# Altium schematic sheet MCU.SchDoc
size A4; Organization: Altium Limited; Address1: L3, 12a Rodborough Rd; Address2: Frenchs Forest; Address3: NSW; Address4: Australia 2086
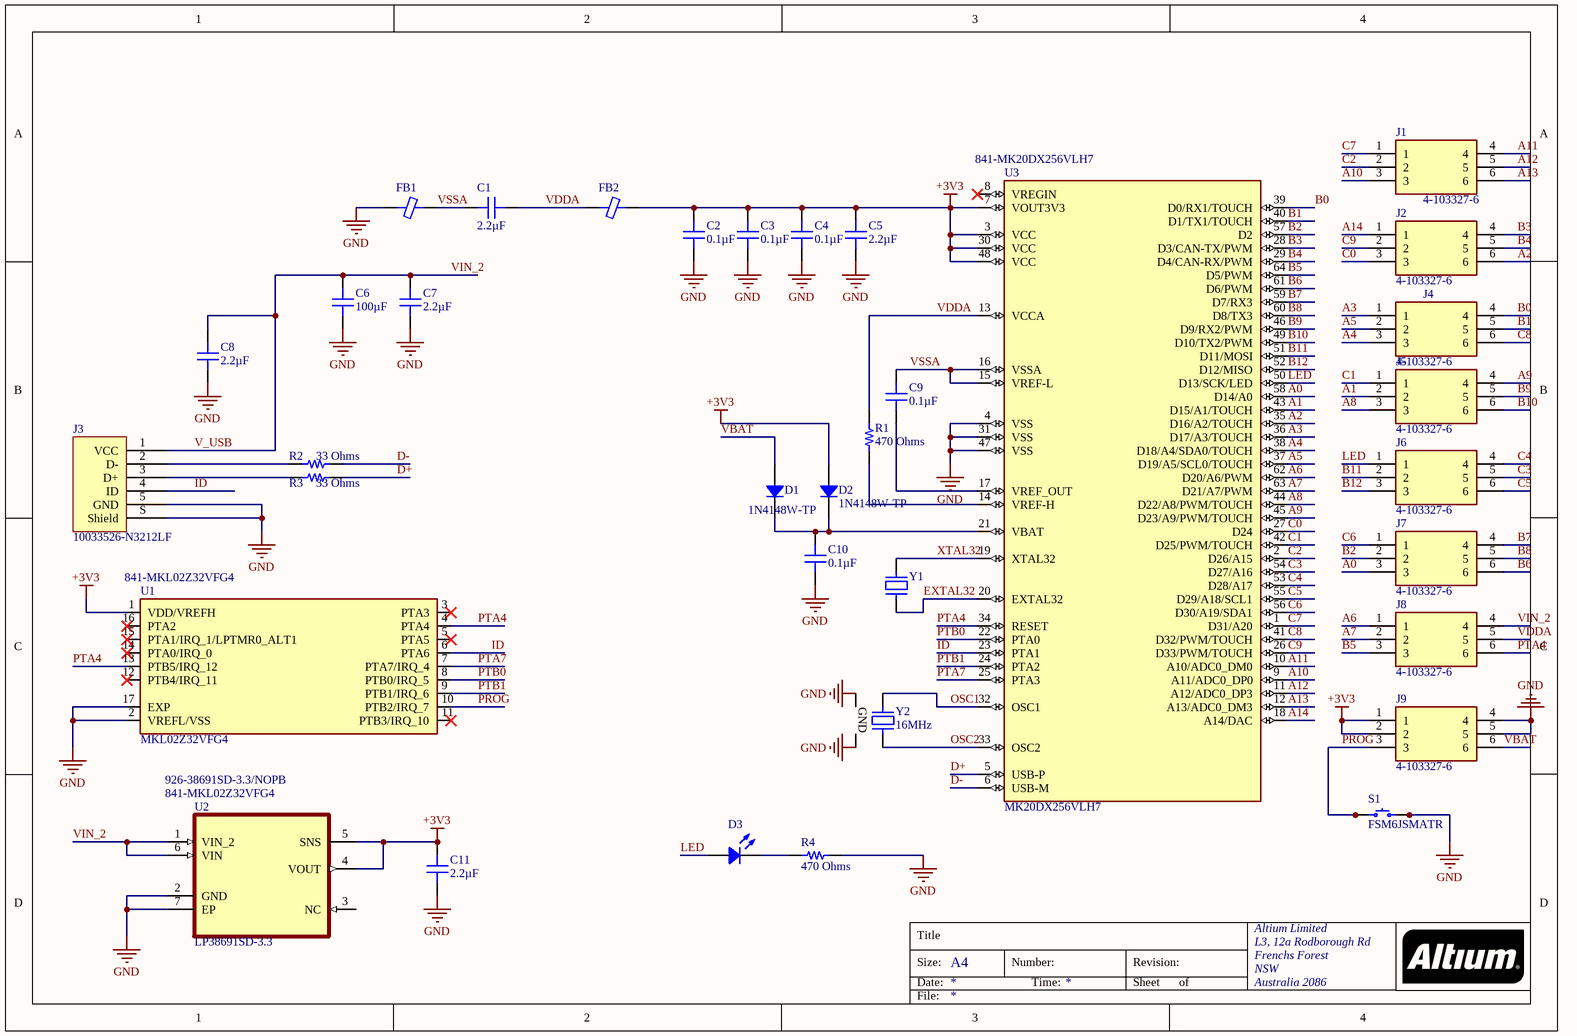
[diagram p0: MCU.SchDoc]

## Parts
C1  2.2µF  [CAP 0805_2012]
C2  0.1µF  [CAP 0805_2012]
C3  0.1µF  [CAP 0805_2012]
C4  0.1µF  [CAP 0805_2012]
C5  2.2µF  [CAP 0805_2012]
C6  100µF  [CAP 0805_2012]
C7  2.2µF  [CAP 0805_2012]
C8  2.2µF  [CAP 0805_2012]
C9  0.1µF  [CAP 0805_2012]
C10  0.1µF  [CAP 0805_2012]
C11  2.2µF  [CAP 0805_2012]
D1  1N4148W-TP  [SOD-123]
D2  1N4148W-TP  [SOD-123]
D3  JE2835AWT-00-0000-000A0HG830E  [CREE J 2835]  (value not drawn)
FB1  600 Ohms @ 100MHz  [FER 0805_2012]  (value not drawn)
FB2  600 Ohms @ 100MHz  [FER 0805_2012]  (value not drawn)
J1  4-103327-6  [TE_4-103327-6]
J2  4-103327-6  [TE_4-103327-6]
J3  10033526-N3212LF  [FCI USB 10033526-N3212LF]
J4  4-103327-6  [TE_4-103327-6]
J5  4-103327-6  [TE_4-103327-6]
J6  4-103327-6  [TE_4-103327-6]
J7  4-103327-6  [TE_4-103327-6]
J8  4-103327-6  [TE_4-103327-6]
J9  4-103327-6  [TE_4-103327-6]
R1  470 Ohms  [RES 0805_2012]
R2  33 Ohms  [RES 0805_2012]
R3  33 Ohms  [RES 0805_2012]
R4  470 Ohms  [RES 0805_2012]
S1  FSM6JSMATR  [TE FSM6JSMA]
U1  MKL02Z32VFG4  Supplier Part Number 1: 841-MKL02Z32VFG4  [QFN50P300X300X65-17N]
U2  LP38691SD-3.3  Supplier Part Number 1: 841-MKL02Z32VFG4  Supplier Part Number 2: 926-38691SD-3.3/NOPB  [DFN300X300X80-7N]
U3  MK20DX256VLH7  Supplier Part Number 1: 841-MK20DX256VLH7  [QFP50P1200X1200X160-64N]
Y1  32.768kHz  [ABRACON ABS06]  (value not drawn)
Y2  16MHz  [NDK NX3225SA]

## Nets
+3V3: C2.2 C3.2 C4.2 C5.2 C11.2 D2.1 FB2.1 J9.1 J9.2 U1.1(VDD/VREFH) U2.4(VOUT) U2.5(SNS) U3.3(VCC) U3.7(VOUT3V3) U3.30(VCC) U3.48(VCC)
GND: C2.1 C3.1 C4.1 C5.1 C6.1 C7.1 C8.1 C10.1 C11.1 FB1.2 J3.5(GND) J3.S(Shield) J9.4 J9.5 R4.2 S1.3 S1.4 U1.2(VREFL/VSS) U1.17(EXP) U2.2(GND) U2.7(EP) U3.4(VSS) U3.31(VSS) U3.47(VSS) Y2.2(GND) Y2.4(GND)
A0: J7.3 U3.58(D14/A0)
A1: J5.2 U3.43(D15/A1/TOUCH)
A2: J2.6 U3.35(D16/A2/TOUCH)
A3: J4.1 U3.36(D17/A3/TOUCH)
A4: J4.3 U3.38(D18/A4/SDA0/TOUCH)
A5: J4.2 U3.37(D19/A5/SCL0/TOUCH)
A6: J8.1 U3.62(D20/A6/PWM)
A7: J8.2 U3.63(D21/A7/PWM)
A8: J5.3 U3.44(D22/A8/PWM/TOUCH)
A9: J5.4 U3.45(D23/A9/PWM/TOUCH)
A10: J1.3 U3.9(A11/ADC0_DP0)
A11: J1.4 U3.10(A10/ADC0_DM0)
A12: J1.5 U3.11(A12/ADC0_DP3)
A13: J1.6 U3.12(A13/ADC0_DM3)
A14: J2.1 U3.18(A14/DAC)
B0: J4.4 U3.39(D0/RX1/TOUCH)
B1: J4.5 U3.40(D1/TX1/TOUCH)
B2: J7.2 U3.57(D2)
B3: J2.4 U3.28(D3/CAN-TX/PWM)
B4: J2.5 U3.29(D4/CAN-RX/PWM)
B5: J8.3 U3.64(D5/PWM)
B6: J7.6 U3.61(D6/PWM)
B7: J7.4 U3.59(D7/RX3)
B8: J7.5 U3.60(D8/TX3)
B9: J5.5 U3.46(D9/RX2/PWM)
B10: J5.6 U3.49(D10/TX2/PWM)
B11: J6.2 U3.51(D11/MOSI)
B12: J6.3 U3.52(D12/MISO)
C0: J2.3 U3.27(D24)
C1: J5.1 U3.42(D25/PWM/TOUCH)
C2: J1.2 U3.2(D26/A15)
C3: J6.5 U3.54(D27/A16)
C4: J6.4 U3.53(D28/A17)
C5: J6.6 U3.55(D29/A18/SCL1)
C6: J7.1 U3.56(D30/A19/SDA1)
C7: J1.1 U3.1(D31/A20)
C8: J4.6 U3.41(D32/PWM/TOUCH)
C9: J2.2 U3.26(D33/PWM/TOUCH)
D+: R3.2 U3.5(USB-P)
D-: R2.2 U3.6(USB-M)
EXTAL32: U3.20(EXTAL32) Y1.1
ID: J3.4(ID) U1.6(PTA6) U3.23(PTA1)
LED: D3.1 J6.1 U3.50(D13/SCK/LED)
OSC1: U3.32(OSC1) Y2.1
OSC2: U3.33(OSC2) Y2.3
PROG: J9.3 S1.1 S1.2 U1.10(PTB2/IRQ_7)
PTA4: J8.6 U1.4(PTA4) U1.13(PTB5/IRQ_12) U3.34(RESET)
PTA7: U1.7(PTA7/IRQ_4) U3.25(PTA3)
PTB0: U1.8(PTB0/IRQ_5) U3.22(PTA0)
PTB1: U1.9(PTB1/IRQ_6) U3.24(PTA2)
V_USB: C6.2 C7.2 C8.2 J3.1(VCC) J8.4 U2.1(VIN_2) U2.6(VIN)  [also labelled VIN_2]
VBAT: D1.1 J9.6
VDDA: C1.1 FB2.2 J8.5 R1.2 U3.13(VCCA)
VSSA: C1.2 C9.2 FB1.1 U3.15(VREF-L) U3.16(VSSA)
XTAL32: U3.19(XTAL32) Y1.2
NetC9_1: C9.1 U3.17(VREF_OUT)
NetC10_2: C10.2 D1.2 D2.2 U3.21(VBAT)
NetD3_2: D3.2 R4.1
NetJ3_2: J3.2(D-) R2.1
NetJ3_3: J3.3(D+) R3.1
NetR1_1: R1.1 U3.14(VREF-H)

Not connected (* = marked no-connect by the designer): U1 3(PTA3)* 5(PTA5)* 11(PTB3/IRQ_10)* 12(PTB4/IRQ_11)* 14(PTA0/IRQ_0)* 15(PTA1/IRQ_1/LPTMR0_ALT1)* 16(PTA2)*; U2 3(NC); U3 8(VREGIN)*

## Notes on the sheet
- Title
- Size:
- Date:
- A4
- Number:
- Time:
- Revision:
- Sheet
- of
- File:

## Library data of the parts
C1 C5 C7 C8 C11 = CGA4J3X7R1H225K125AB: CAP CER 2.2UF 50V X7R 0805; Manufacturer: TDK Corporation; Tolerance: ±10%; Part Number: CGA4J3X7R1H225K125AB; Value: 2.2µF; Applications: Automotive; Capacitance: 2.2µF; ComponentLink1Description: Datasheet; ComponentLink1URL: https://product.tdk.com/info/en/catalog/datasheets/mlcc_automotive_general_en.pdf?ref_disty=digikey; ComponentLink2Description: DigiKey Link; ComponentLink2URL: http://digikey.com/product-detail/en/tdk-corporation/CGA4J3X7R1H225K125AB/445-174216-1-ND/5823086; Device Package: 0805 (2012 Metric); LastUpdated: 21.01.2020 00:03:05; Lifecycle Status: Active; Minimum Order: 1; Mounting Type: Surface Mount, MLCC; Operating Temperature: -55°C ~ 125°C; Package / Case: 0805 (2012 Metric); Packaging: TapeAndReel; PartId: 3113; Part Status: Active; Price: 0.12; Ratings: AEC-Q200; Series: CGA; Size / Dimension: 0.079" L x 0.049" W (2.00mm x 1.25mm); Supplier 1: DigiKey; Supplier Part Number 1: 445-174216-1-ND; Temperature Coefficient: X7R; Thickness (Max): 0.057" (1.45mm); Voltage - Rated: 50V
C2-C4 C9 C10 = C0805C104K1RECAUTO: CAP CER 0805 0.1UF 100V X7R; Manufacturer: KEMET; Tolerance: ±10%; Part Number: C0805C104K1RECAUTO; Value: 0.1µF; Applications: Automotive, ESD Protection; Capacitance: 0.1µF; ComponentLink1Description: Datasheet; ComponentLink1URL: https://api.kemet.com/component-edge/download/datasheet/C0805C104K1RECAUTO.pdf; ComponentLink2Description: DigiKey Link; ComponentLink2URL: http://digikey.com/product-detail/en/kemet/C0805C104K1RECAUTO/399-17169-1-ND/8563710; Device Package: 0805 (2012 Metric); LastUpdated: 21.01.2020 00:03:01; Lifecycle Status: Active; Minimum Order: 1; Mounting Type: Surface Mount, MLCC; Operating Temperature: -55°C ~ 125°C; Package / Case: 0805 (2012 Metric); Packaging: TapeAndReel; PartId: 5890; Part Status: Active; Price: 0.06; Ratings: AEC-Q200; Series: ESD SMD Auto X7R; Size / Dimension: 0.079" L x 0.049" W (2.00mm x 1.25mm); Supplier 1: DigiKey; Supplier Part Number 1: 399-17169-1-ND; Temperature Coefficient: X7R; Thickness (Max): 0.043" (1.10mm); Voltage - Rated: 100V
C6 = GRM21BR60J107ME15L: CAP CER 100UF 6.3V X5R 0805; Manufacturer: Murata Electronics; Tolerance: ±20%; Part Number: GRM21BR60J107ME15L; Value: 100µF; Applications: General Purpose; Capacitance: 100µF; ComponentLink1Description: Datasheet; ComponentLink1URL: https://search.murata.co.jp/Ceramy/image/img/A01X/G101/ENG/GRM21BR60J107ME15-01.pdf; ComponentLink2Description: DigiKey Link; ComponentLink2URL: http://digikey.com/product-detail/en/murata-electronics/GRM21BR60J107ME15L/490-13981-1-ND/6155811; Device Package: 0805 (2012 Metric); LastUpdated: 21.01.2020 00:02:41; Lifecycle Status: Active; Minimum Order: 1; Mounting Type: Surface Mount, MLCC; Operating Temperature: -55°C ~ 85°C; Package / Case: 0805 (2012 Metric); Packaging: TapeAndReel; PartId: 16995; Part Status: Active; Price: 0.65; Series: GRM; Size / Dimension: 0.079" L x 0.049" W (2.00mm x 1.25mm); Supplier 1: DigiKey; Supplier Part Number 1: 490-13981-1-ND; Temperature Coefficient: X5R; Thickness (Max): 0.057" (1.45mm); Voltage - Rated: 6.3V
D1 D2 = 1N4148W-TP: DIODE GEN PURP 100V 150MA SOD123; Manufacturer: Micro Commercial Co; Capacitance @ Vr, F: 2pF @ 0V, 1MHz; Current - Reverse Leakage @ Vr: 1µA @ 75V; Diode Type: Standard; Reverse Recovery Time (trr): 4ns; Speed: Small Signal =< 200mA (Io), Any Speed; Voltage - Forward (Vf) (Max) @ If: 1.25V @ 150mA; Part Number: 1N4148W-TP; ComponentLink1Description: Datasheet; ComponentLink1URL: https://www.mccsemi.com/pdf/Products/1N4148W(SOD123).pdf; ComponentLink2Description: DigiKey Link; ComponentLink2URL: http://digikey.com/product-detail/en/micro-commercial-co/1N4148W-TP/1N4148WTPMSCT-ND/717311; Current - Average Rectified (Io): 150mA; Device Package: SOD-123; LastUpdated: 21.01.2020 02:42:46; Lifecycle Status: Active; Minimum Order: 1; Mounting Type: Surface Mount; Operating Temperature - Junction: -65°C ~ 150°C; Package / Case: SOD-123; Packaging: TapeAndReel; PartId: 999; Part Status: Active; Price: 0.02; Series: -; Supplier 1: DigiKey; Supplier Part Number 1: 1N4148WTPMSCT-ND; Supplier Device Package: SOD-123; Voltage - DC Reverse (Vr) (Max): 100V
D3 = JE2835AWT-00-0000-000A0HG830E: CREE J SERIES JE2835 LIGHT EMITT; Manufacturer: Cree Inc.; CCT (K): 3000K; Color: 0.138" L x 0.110" W (3.50mm x 2.80mm); CRI (Color Rendering Index): 80; Current - Max: 240mA; Current - Test: 150mA; Flux @ 25°C, Current - Test: 70lm (Typ); Lumens/Watt @ Current - Test: 156 lm/W; Viewing Angle: 120°; Voltage - Forward (Vf) (Typ): 3V; Part Number: JE2835AWT-00-0000-000A0HG830E; ComponentLink1Description: Datasheet; ComponentLink1URL: https://www.cree.com/led-components/media/documents/data-sheet-JSeries-2835-3v.pdf; ComponentLink2Description: DigiKey Link; ComponentLink2URL: http://digikey.com/product-detail/en/cree-inc/JE2835AWT-00-0000-000A0HG830E/JE2835AWT-00-0000-000A0HG830ECT-ND/9974552; Device Package: 1113 (2835 Metric); Height - Seated (Max): 0.035" (0.90mm); LastUpdated: 2.04.2020 13:35:29; Lifecycle Status: Active; Minimum Order: 1; Mounting Type: Surface Mount; Package / Case: 1113 (2835 Metric); Packaging: TapeAndReel; PartId: 48; Part Status: 1113 (2835 Metric); Price: 0.02; Series: J; Size / Dimension: 0.138" L x 0.110" W (3.50mm x 2.80mm); Supplier 1: DigiKey; Supplier Part Number 1: JE2835AWT-00-0000-000A0HG830ECT-ND; Supplier Device Package: SMD
FB1 FB2 = MPZ2012S601AT000: FERRITE BEAD 600 OHM 0805 1LN; Manufacturer: TDK Corporation; Current Rating (Max): 2A; DC Resistance (DCR) (Max): 100mOhm; Filter Type: Power Line; Number of Lines: 1; Part Number: MPZ2012S601AT000; ComponentLink1Description: Datasheet; ComponentLink1URL: https://product.tdk.com/info/en/catalog/datasheets/beads_commercial_power_mpz2012_en.pdf?ref_disty=digikey; ComponentLink2Description: DigiKey Link; ComponentLink2URL: http://digikey.com/product-detail/en/tdk-corporation/MPZ2012S601AT000/445-2206-1-ND/765104; Device Package: 0805 (2012 Metric); Height (Max): 0.041" (1.05mm); Impedance @ Frequency: 600 Ohms @ 100MHz; LastUpdated: 21.01.2020 02:29:16; Lifecycle Status: Active; Minimum Order: 1; Mounting Type: Surface Mount; Operating Temperature: -55°C ~ 125°C; Package / Case: 0805 (2012 Metric); Packaging: TapeAndReel; PartId: 1392; Part Status: Active; Price: 0.03; Series: MPZ; Size / Dimension: 0.079" L x 0.049" W (2.00mm x 1.25mm); Supplier 1: DigiKey; Supplier Part Number 1: 445-2206-1-ND; Value: 600 Ohms @ 100MHz
J1 J2 J4-J9 = 4-103327-6: 6 Position Single Row 2.54 mm Through-Hole Straight AMPMODU Breakaway Header; Centerline_Pitch: 2.54 mm[.1 in]; MF: TE Connectivity; Product_Type: Connector; Number_of_Positions: 6; SnapEDA_Link: https://www.snapeda.com/parts/4-103327-6/TE%20Connectivity%20AMP%20Connectors/view-part/2779147/?ref=snap; TE_purchase_URL: https://www.te.com/usa-en/product-4-103327-6.html?te_bu=Cor&te_type=disp&te_campaign=seda_glo_cor-seda-global-disp-prtnr-fy19-seda-model-bom-cta_sma-317_1&elqCampaignId=32493; Availability: Unavailable; Price: None; MP: 4-103327-6; Package: None; Value: *
J3 = 10033526-N3212LF: CONN RCPT MINI USB B 5POS SMD RA; Manufacturer: Amphenol ICC (FCI); Connector Type: USB - mini B; Current Rating (Amps): 1A per Contact; Gender: Receptacle; Mating Cycles: 5000; Number of Contacts: 5; Number of Ports: 1; Shielding: Shielded; Voltage - Rated: 30V; Part Number: 10033526-N3212LF; ComponentLink1Description: Datasheet; ComponentLink1URL: http://www.amphenol-icc.com/media/wysiwyg/files/drawing/10033526.pdf; ComponentLink2Description: DigiKey Link; ComponentLink2URL: //digikey.com/product-detail/en/amphenol-icc-fci/10033526-N3212LF/609-4700-2-ND/4292074; Features: Board Guide, Solder Retention; LastUpdated: 9.12.2019 20:52:14; Lifecycle Status: 0; Minimum Order: 1; Mounting Feature: Horizontal; Mounting Type: Surface Mount, Right Angle; Operating Temperature: -25°C ~ 85°C; Packaging: TapeAndReel; Part Status: Active; Price: 0.39; Series: -; Supplier 1: DigiKey; Supplier Part Number 1: 609-4700-2-ND; Termination: Solder
R1 = CPF0805B470RE1: RES SMD 470 OHM 0.1% 1/10W 0805; Manufacturer: TE Connectivity Passive Product; Power (Watts): 0.1W, 1/10W; Temperature Coefficient: ±25ppm/°C; Part Number: CPF0805B470RE1; Value: 470 Ohms; ComponentLink1Description: Datasheet; ComponentLink1URL: https://www.te.com/commerce/DocumentDelivery/DDEController?Action=srchrtrv&DocNm=1773200&DocType=DS&DocLang=English; ComponentLink2Description: DigiKey Link; ComponentLink2URL: http://digikey.com/product-detail/en/te-connectivity-passive-product/CPF0805B470RE1/A103263CT-ND/2728833; Composition: Thin Film; Device Package: 0805 (2012 Metric); Height - Seated (Max): 0.026" (0.65mm); LastUpdated: 21.01.2020 01:48:16; Lifecycle Status: Active; Minimum Order: 1; Number of Terminations: 2; Operating Temperature: -55°C ~ 155°C; Package / Case: 0805 (2012 Metric); Packaging: TapeAndReel; PartId: 31840; Part Status: Active; Price: 0.12; Resistance: 470 Ohms; Series: CPF, Neohm; Size / Dimension: 0.079" L x 0.049" W (2.00mm x 1.25mm); Supplier 1: DigiKey; Supplier Part Number 1: A103263CT-ND; Supplier Device Package: 0805; Tolerance: ±0.1%
R2 R3 = CPF0805B33RE1: RES SMD 33 OHM 0.1% 1/10W 0805; Manufacturer: TE Connectivity Passive Product; Power (Watts): 0.1W, 1/10W; Temperature Coefficient: ±25ppm/°C; Part Number: CPF0805B33RE1; Value: 33 Ohms; ComponentLink1Description: Datasheet; ComponentLink1URL: https://www.te.com/commerce/DocumentDelivery/DDEController?Action=srchrtrv&DocNm=1773200&DocType=DS&DocLang=English; ComponentLink2Description: DigiKey Link; ComponentLink2URL: http://digikey.com/product-detail/en/te-connectivity-passive-product/CPF0805B33RE1/A103197CT-ND/2728757; Composition: Thin Film; Device Package: 0805 (2012 Metric); Height - Seated (Max): 0.026" (0.65mm); LastUpdated: 21.01.2020 01:40:43; Lifecycle Status: Active; Minimum Order: 1; Number of Terminations: 2; Operating Temperature: -55°C ~ 155°C; Package / Case: 0805 (2012 Metric); Packaging: TapeAndReel; PartId: 47504; Part Status: Active; Price: 0.12; Resistance: 33 Ohms; Series: CPF, Neohm; Size / Dimension: 0.079" L x 0.049" W (2.00mm x 1.25mm); Supplier 1: DigiKey; Supplier Part Number 1: A103197CT-ND; Supplier Device Package: 0805; Tolerance: ±0.1%
R4 = RMCF0805FT470R: RES 470 OHM 1% 1/8W 0805; Manufacturer: Stackpole Electronics Inc; Power (Watts): 0.125W, 1/8W; Temperature Coefficient: ±100ppm/°C; Part Number: RMCF0805FT470R; Value: 470 Ohms; ComponentLink1Description: Datasheet; ComponentLink1URL: https://www.seielect.com/catalog/sei-packaging.pdf; ComponentLink2Description: DigiKey Link; ComponentLink2URL: http://digikey.com/product-detail/en/stackpole-electronics-inc/RMCF0805FT470R/RMCF0805FT470RCT-ND/1942356; Composition: Thick Film; Device Package: 0805 (2012 Metric); Features: Automotive AEC-Q200; Height - Seated (Max): 0.026" (0.65mm); LastUpdated: 21.01.2020 01:48:04; Lifecycle Status: Active; Minimum Order: 1; Number of Terminations: 2; Operating Temperature: -55°C ~ 155°C; Package / Case: 0805 (2012 Metric); Packaging: CutTape; PartId: 32394; Part Status: Active; Price: 0.10; Ratings: AEC-Q200; Resistance: 470 Ohms; Series: RMCF; Size / Dimension: 0.079" L x 0.049" W (2.00mm x 1.25mm); Supplier 1: DigiKey; Supplier Part Number 1: RMCF0805FT470RCT-ND; Supplier Device Package: 0805; Tolerance: ±1%
S1 = FSM6JSMATR: SWITCH TACTILE SPST-NO 0.05A 24V; Manufacturer: TE Connectivity ALCOSWITCH Switches; Actuator Height off PCB, Vertical: 7.00mm; Actuator Orientation: Top Actuated; Actuator Type: Standard; Contact Rating @ Voltage: 0.05A @ 24VDC; Illumination: Non-Illuminated; Operating Force: 160gf; Outline: 6.00mm x 6.00mm; Switch Function: Off-Mom; Part Number: FSM6JSMATR; Circuit: SPST-NO; ComponentLink1Description: Datasheet; ComponentLink1URL: https://www.te.com/commerce/DocumentDelivery/DDEController?Action=srchrtrv&DocNm=1308111-1_SWITCHES_CORE_PROGRAM_CATALOG&DocType=CS&DocLang=English; ComponentLink2Description: DigiKey Link; ComponentLink2URL: http://digikey.com/product-detail/en/te-connectivity-alcoswitch-switches/FSM6JSMATR/450-2058-1-ND/4569748; LastUpdated: 4.02.2020 14:39:39; Lifecycle Status: Active; Minimum Order: 1; Mounting Type: Surface Mount; Operating Temperature: -35°C ~ 85°C; Packaging: TapeAndReel; Part Status: Active; Price: 0.25; Series: FSMJSMA; Supplier 1: DigiKey; Supplier Part Number 1: 450-2058-1-ND; Termination Style: Gull Wing
U1 = MKL02Z32VFG4: IC MCU 32BIT 32KB FLASH 16QFN; Manufacturer: NXP Freescale; MF: NXP USA; Frequency: 48MHz; Number of I/Os: 14; Oscillator Type: Internal; Data Bus Width: 32b; Core Architecture: ARM; Max Supply Voltage: 3.6V; RAM Size: 4KB; Number of Timers/Counters: 2; Peripherals: Brown-out Detect/Reset,POR,PWM,WDT,LVD; Interface: I2C,SPI,UART,USART; Min Supply Voltage: 1.71V; Number of SPI Channels: 1; Availability: Unavailable; MP: MKL02Z32VFG4; Price: None; Value: *; SnapEDA_Link: https://www.snapeda.com/parts/MKL02Z32VFG4/NXP%20USA%20Inc./view-part/492537/?ref=snap; Package: QFN-16 NXP Semiconductors; Supplier 1: Mouser; Manufacturer Part Number: MKL02Z32VFG4; RoHS: Yes; Category: Microcontrollers; Stock 1: 3878; Pricing 1: 1=2.49000, 10=2.12000, 100=1.69000, 500=1.48000, 1000=1.22000, 2500=1.14000 (USD); Mount: Surface Mount; Case/Package: QFN; Number of Pins: 16; Weight: 0.000564oz; Min Operating Temperature: -40°C; Max Operating Temperature: 105°C; Max Frequency: 48MHz; Memory Type: FLASH; Memory Size: 32KB; Packaging: Tray; Package Quantity: 490; Number of I2C Channels: 2; Number of USB Channels: 1; Number of PWM Channels: 2; Number of ADC Channels: 1; Number of UART Channels: 1; Length: 3mm; Height: 0.75mm; Width: 3mm; REACH SVHC: No SVHC; ComponentLink1URL: https://datasheet.ciiva.com/18627/kl02p32m48sf0-18627235.pdf?src-supplier=Digi-Key; ComponentLink1Description: https://datasheet.ciiva.com/18627/kl02p32m48sf0-18627235.pdf?src-supplier=Digi-Key; ComponentLink2URL: https://datasheet.ciiva.com/30476/0900766b812babaa-30476287.pdf?src-supplier=RSComponents; ComponentLink2Description: https://datasheet.ciiva.com/30476/0900766b812babaa-30476287.pdf?src-supplier=RSComponents; ComponentLink3URL: https://datasheet.ciiva.com/46450/1816137-46450442.pdf?src-supplier=Element14; ComponentLink3Description: https://datasheet.ciiva.com/46450/1816137-46450442.pdf?src-supplier=Element14
U2 = LP38691SD-3.3: IC REG LINEAR 3.3V 500MA 6WSON; Manufacturer: TI National Semiconductor; Manufacturer Part Number: LP38691SD-3.3/NOPB; MF: Texas Instruments; Number of Outputs: 1; Min Input Voltage: 2.7V; Max Input Voltage: 10V; Quiescent Current: 100uA; Accuracy: 2%; Polarity: Positive; Output Type: Fixed; Dropout Voltage: 330mV; Price: None; Value: *; Package: WDFN-6 Texas Instruments; Availability: Unavailable; SnapEDA_Link: https://www.snapeda.com/parts/LP38691SD-3.3/Texas%20Instruments/view-part/569979/?ref=snap; MP: LP38691SD-3.3; Supplier 1: Mouser; Supplier 2: Mouser; RoHS: Yes; Category: Voltage Regulators - Linear; Stock 2: 6886; Pricing 2: 1=1.70000, 10=1.44000, 100=1.15000, 250=1.01000, 500=0.97800, 1000=0.77700 (USD); Mount: Surface Mount; Number of Pins: 6; Contact Plating: Tin; Min Operating Temperature: -40°C; Max Operating Temperature: 125°C; Max Output Current: 500mA; Output Voltage: 3.3V; Output Voltage Accuracy: 2%; Output Current: 500mA; Packaging: Tape and Reel; Package Quantity: 1000; Number of Regulators: 1; Nominal Output Voltage: 3.3V; Length: 3mm; Height: 0.86mm; Width: 3mm; Radiation Hardening: No; Lead Free: Lead Free; REACH SVHC: No SVHC; ComponentLink1URL: https://datasheet.ciiva.com/25626/0900766b810fa755-25626721.pdf?src-supplier=RSComponents; ComponentLink1Description: https://datasheet.ciiva.com/25626/0900766b810fa755-25626721.pdf?src-supplier=RSComponents; ComponentLink2URL: https://datasheet.ciiva.com/3223/lp38693-3223928.pdf?src-supplier=Avnet; ComponentLink2Description: https://datasheet.ciiva.com/3223/lp38693-3223928.pdf?src-supplier=Avnet; ComponentLink3URL: https://datasheet.ciiva.com/3223/lp38693-3223929.pdf?src-supplier=Avnet; ComponentLink3Description: https://datasheet.ciiva.com/3223/lp38693-3223929.pdf?src-supplier=Avnet; ComponentLink4URL: https://datasheet.ciiva.com/6596/lp38691-6596239.pdf?src-supplier=Digi-Key; ComponentLink4Description: https://datasheet.ciiva.com/6596/lp38691-6596239.pdf?src-supplier=Digi-Key; ComponentLink5URL: https://datasheet.ciiva.com/46385/1887481-46385397.pdf?src-supplier=Element14; ComponentLink5Description: https://datasheet.ciiva.com/46385/1887481-46385397.pdf?src-supplier=Element14; ComponentLink6URL: https://datasheet.ciiva.com/28643/1887481-28643014.pdf?src-supplier=Element14; ComponentLink6Description: https://datasheet.ciiva.com/28643/1887481-28643014.pdf?src-supplier=Element14; ComponentLink7URL: https://datasheet.ciiva.com/6596/lp38691-6596237.pdf?src-supplier=Digi-Key; ComponentLink7Description: https://datasheet.ciiva.com/6596/lp38691-6596237.pdf?src-supplier=Digi-Key
U3 = MK20DX256VLH7: MCU, 32BIT, CORTEX-M4, 72MHZ, LQFP-64; Architecture:ARM Cortex-M4; CPU Speed:72MHz; Program Memory Size:256KB; RAM Memory Size:64KB; No. of Pins:64; MCU Case Style:LQFP; No. of I/Os:40; Embedded Interface Type:CAN, I2C, I2S, SPI, ;RoHS Compliant: Yes; Manufacturer: NXP Freescale; MF: NXP USA; Peripherals: POR,PWM,WDT,DMA,LVD,I2C; Data Bus Width: 32b; Oscillator Type: Internal; Number of ADC Channels: 2; Number of SPI Channels: 1; Number of I/Os: 40; Memory Type: FLASH; Memory Size: 256KB; Number of Timers/Counters: 14; RAM Size: 64KB; Number of PWM Channels: 8; Interface: I2C,SPI,USB,CAN,IrDA,UART,USART,EBI/EMI,I2S; Min Supply Voltage: 1.71V; Max Supply Voltage: 3.6V; Core Architecture: ARM; Number of UART Channels: 3; Package: LQFP-64 NXP Semiconductors; Availability: Unavailable; SnapEDA_Link: https://www.snapeda.com/parts/MK20DX256VLH7/NXP%20USA%20Inc./view-part/625714/?ref=snap; MP: MK20DX256VLH7; Price: None; Value: *; Supplier 1: Mouser; Manufacturer Part Number: MK20DX256VLH7; RoHS: Yes; Category: Microcontrollers; Stock 1: 1822; Pricing 1: 1=8.66000, 10=7.82000, 25=7.46000, 100=6.45000, 250=6.19000, 500=5.64000 (USD); Mount: Surface Mount; Case/Package: LQFP; Number of Pins: 64; Weight: 0.012224oz; Contact Plating: Tin,Matte; Min Operating Temperature: -40°C; Max Operating Temperature: 105°C; Watchdog Timer: Yes; Max Frequency: 72MHz; Number of I2C Channels: 2; Packaging: Tray; Package Quantity: 160; Number of USB Channels: 1; Frequency: 72MHz; Length: 10mm; Height: 1.6mm; Width: 10mm; Radiation Hardening: No; REACH SVHC: No SVHC; Lead Free: Lead Free; Halogen Free: Halogen Free; ComponentLink1URL: https://datasheet.ciiva.com/4842/k20pb-41960-4842272.pdf?src-supplier=Mouser; ComponentLink1Description: https://datasheet.ciiva.com/4842/k20pb-41960-4842272.pdf?src-supplier=Mouser; ComponentLink2URL: https://datasheet.ciiva.com/30475/0900766b812ba3f0-30475861.pdf?src-supplier=RSComponents; ComponentLink2Description: https://datasheet.ciiva.com/30475/0900766b812ba3f0-30475861.pdf?src-supplier=RSComponents; ComponentLink3URL: https://datasheet.ciiva.com/9232/k20p64m72sf1-9232727.pdf?src-supplier=Avnet; ComponentLink3Description: https://datasheet.ciiva.com/9232/k20p64m72sf1-9232727.pdf?src-supplier=Avnet
Y1 = ABS06-32.768KHZ-1-T: CRYSTAL 32.7680KHZ 12.5PF SMD; Manufacturer: Abracon LLC; ESR (Equivalent Series Resistance): 90 kOhms; Frequency Tolerance: ±10ppm; Operating Mode: Fundamental; Part Number: ABS06-32.768KHZ-1-T; ComponentLink1Description: Datasheet; ComponentLink1URL: https://abracon.com/Resonators/ABS06.pdf; ComponentLink2Description: DigiKey Link; ComponentLink2URL: http://digikey.com/product-detail/en/abracon-llc/ABS06-32.768KHZ-1-T/535-10248-1-ND/2218061; Device Package: 2-SMD, No Lead; Frequency: 32.768kHz; Height - Seated (Max): 0.024" (0.60mm); LastUpdated: 21.01.2020 03:21:15; Lifecycle Status: Active; Load Capacitance: 12.5pF; Minimum Order: 1; Mounting Type: Surface Mount; Operating Temperature: -40°C ~ 85°C; Package / Case: 2-SMD, No Lead; Packaging: CutTape; PartId: 370; Part Status: Active; Price: 0.80; Series: ABS06; Size / Dimension: 0.079" L x 0.047" W (2.00mm x 1.20mm); Supplier 1: DigiKey; Supplier Part Number 1: 535-10248-1-ND; Type: kHz Crystal (Tuning Fork); Value: 32.768kHz
Y2 = NX3225SA-16.000M-STD-CSR-1: CRYSTAL 16.0000MHZ 8PF SMD; Manufacturer: NDK America, Inc.; ESR (Equivalent Series Resistance): 80 Ohms; Frequency Stability: ±15ppm; Operating Mode: Fundamental; Part Number: NX3225SA-16.000M-STD-CSR-1; ComponentLink1Description: Datasheet; ComponentLink1URL: //media.digikey.com/pdf/Data%20Sheets/NDK%20PDFs/NX3225SA.pdf; ComponentLink2Description: DigiKey Link; ComponentLink2URL: http://digikey.com/product-detail/en/ndk-america-inc/NX3225SA-16.000M-STD-CSR-1/644-1049-1-ND/1128921; Device Package: 4-SMD, No Lead; Frequency: 16MHz; Frequency Tolerance: ±15ppm; Height - Seated (Max): 0.024" (0.60mm); LastUpdated: 21.01.2020 03:23:16; Lifecycle Status: Active; Load Capacitance: 8pF; Minimum Order: 1; Mounting Type: Surface Mount; Operating Temperature: -10°C ~ 75°C; Package / Case: 4-SMD, No Lead; Packaging: TapeAndReel; PartId: 582; Part Status: Active; Price: 0.38; Series: NX3225SA; Size / Dimension: 0.126" L x 0.098" W (3.20mm x 2.50mm); Supplier 1: DigiKey; Supplier Part Number 1: 644-1049-1-ND; Type: MHz Crystal; Value: 16MHz